# EAGLE design controller (EAGLE 5.11)
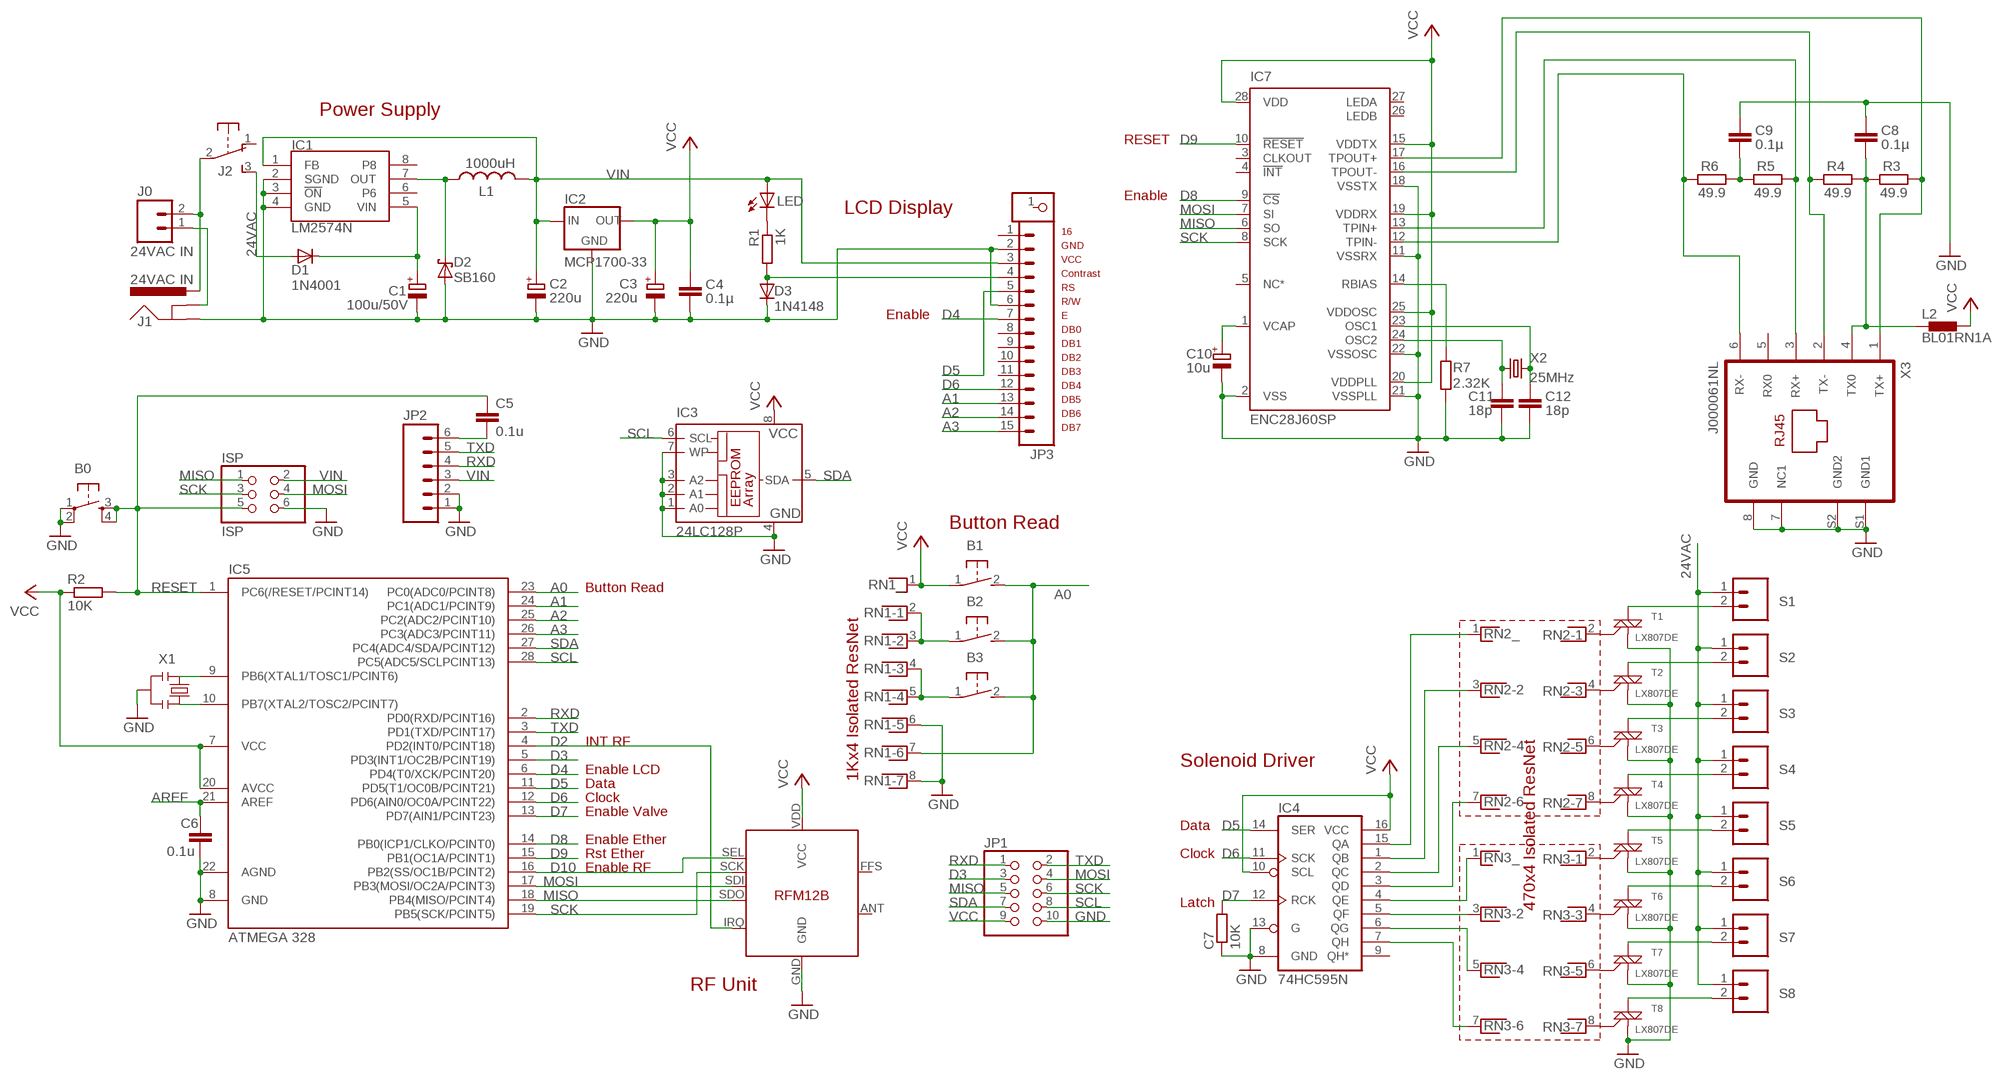
[diagram p0: schematic, sheet 1]

## Parts
B0  TAC_SWITCHPTH  [TACTILE-PTH]
B1  31-XX  [B3F-31XX]
B2  31-XX  [B3F-31XX]
B3  31-XX  [B3F-31XX]
C1  100u/50V  CPOL-EUE3.5-8  [E3,5-8]
C2  220u  CPOL-EUE2-5  [E2-5]
C3  220u  CPOL-EUE2-5  [E2-5]
C4  0.1µ  C-EU025-024X044  [C025-024X044]
C5  0.1u  C-EU025-024X044  [C025-024X044]
C6  0.1u  C-EU025-024X044  [C025-024X044]
C7  10K  R-EU_0204/7  [0204/7]
C8  0.1µ  C-EU025-024X044  [C025-024X044]
C9  0.1µ  C-EU025-024X044  [C025-024X044]
C10  10u  CPOL-EUE1.8-4  [E1,8-4]
C11  18p  C-EU025-024X044  [C025-024X044]
C12  18p  C-EU025-024X044  [C025-024X044]
D1  1N4001  DIODE-DO41-7.6  [DO41-7.6]
D2  SB160  1N5817-B  [DO41-7.6]
D3  1N4148  1N4148DO35-7  [DO35-7]
IC1  LM2574N  [DIL08]
IC2  MCP1700-33  MCP1700INLINE  [TO92-INLINE]
IC3  24LC128P  [DIL8]
IC4  74HC595N  74LS595N  [DIL16]
IC5  ATMEGA 328  ATMEGA48/88/168-PU  [DIL28-3]
IC6  RFM12B  [RFM12B]
IC7  ENC28J60SP  [DIL28-3]
ISP  ISP  PINHD-2X3  [2X03]
J0  24VAC IN  M025MM  [SCREWTERMINAL-5MM-2]
J1  24VAC IN  POWER_JACKPTH_LOCK  [POWER_JACK_PTH_LOCK]
J2  EG1206  [EG1206]
JP1  PINHD-2X5  [2X05]
JP2  M06SIP  [1X06]
JP3  M15  [1X15]
JP4  D  PINHD-1X1  [1X01]
L1  1000uH  L-US6000-XXX-RC  [6000-XXXX-RC]
L2  BL01RN1A  [BL01RN1A]
LED  POWERLED  LED3MM  [LED3MM]
R1  1K  R-EU_0204/7  [0204/7]
R2  10K  R-EU_0204/7  [0204/7]
R3  49.9  R-EU_0204/7  [0204/7]
R4  49.9  R-EU_0204/7  [0204/7]
R5  49.9  R-EU_0204/7  [0204/7]
R6  49.9  R-EU_0204/7  [0204/7]
R7  2.32K  R-EU_0204/7  [0204/7]
RN1  RNX7  [RN-8]
RN2  RNX7  [RN-8]
RN3  RNX7  [RN-8]
S1  M025MM  [SCREWTERMINAL-5MM-2]
S2  M025MM  [SCREWTERMINAL-5MM-2]
S3  M025MM  [SCREWTERMINAL-5MM-2]
S4  M025MM  [SCREWTERMINAL-5MM-2]
S5  M025MM  [SCREWTERMINAL-5MM-2]
S6  M025MM  [SCREWTERMINAL-5MM-2]
S7  M025MM  [SCREWTERMINAL-5MM-2]
S8  M025MM  [SCREWTERMINAL-5MM-2]
T1  LX807DE  [TO-92]
T2  LX807DE  [TO-92]
T3  LX807DE  [TO-92]
T4  LX807DE  [TO-92]
T5  LX807DE  [TO-92]
T6  LX807DE  [TO-92]
T7  LX807DE  [TO-92]
T8  LX807DE  [TO-92]
X1  RESONATORPTH  [RESONATOR-PTH]
X2  25MHz  CRYSTALHC49US  [HC49US]
X3  J000061NL  [PJ-J0-NOLED]

## Nets
24VAC [power]: D1.A J2.3(S) S1.1 S2.1 S3.1 S4.1 S5.1 S6.1 S7.1 S8.1
24VACIN [power]: J0.2 J1.PWR J2.2(P)
A0: B1.2(S) B2.2(S) B3.2(S) IC5.23(PC0(ADC0/PCINT8)) RN1.7
A1: IC5.24(PC1(ADC1/PCINT9)) JP3.13
A2: IC5.25(PC2(ADC2/PCINT10)) JP3.14
A3: IC5.26(PC3(ADC3/PCINT11)) JP3.15
AREF: C6.1 IC5.21(AREF)
D2: IC5.4(PD2(INT0/PCINT18)) IC6.IRQ
D3: IC5.5(PD3(INT1/OC2B/PCINT19)) JP1.3
D4: IC5.6(PD4(T0/XCK/PCINT20)) JP3.7
D5: IC4.14(SER) IC5.11(PD5(T1/OC0B/PCINT21)) JP3.5
D6: IC4.11(SCK) IC5.12(PD6(AIN0/OC0A/PCINT22)) JP3.12
D7: C7.2 IC4.12(RCK) IC5.13(PD7(AIN1/PCINT23))
D8: IC5.14(PB0(ICP1/CLKO/PCINT0)) IC7.9(!CS)
D9: IC5.15(PB1(OC1A/PCINT1)) IC7.10(!RESET)
D10: IC5.16(PB2(SS/OC1B/PCINT2)) IC6.SEL
GND [power]: B0.1 B0.2 C1.- C2.- C3.- C4.2 C6.2 C7.1 C8.1 C9.1 C10.- C11.2 C12.2 D2.A D3.C IC1.2(SGND) IC1.3(!ON) IC1.4(GND) IC2.1(GND) IC3.1(A0) IC3.2(A1) IC3.3(A2) IC3.4(GND) IC3.7(WP) IC4.8(GND) IC4.13(G) IC5.8(GND) IC5.22(AGND) IC6.GND IC7.2(VSS) IC7.11(VSSRX) IC7.18(VSSTX) IC7.21(VSSPLL) IC7.22(VSSOSC) ISP.6 J1.GND JP1.10 JP2.1 JP2.2 JP3.2 JP3.6 R7.2 RN1.6 RN1.8 T1.1(M1) T2.1(M1) T3.1(M1) T4.1(M1) T5.1(M1) T6.1(M1) T7.1(M1) T8.1(M1) X1.2 X3.7(NC1) X3.8(GND) X3.S1(GND1) X3.S2(GND2)
MISO: IC5.18(PB4(MISO/PCINT4)) IC6.SDO IC7.6(SO) ISP.1 JP1.5
MOSI: IC5.17(PB3(MOSI/OC2A/PCINT3)) IC6.SDI IC7.7(SI) ISP.4 JP1.4
N$2: IC5.9(PB6(XTAL1/TOSC1/PCINT6)) X1.1
N$3: RN2.2 T1.2(G)
N$4: IC4.5(QF) RN3.3
N$5: IC4.6(QG) RN3.5
N$6: C5.2 JP2.6
N$7: IC4.7(QH) RN3.7
N$8: IC5.10(PB7(XTAL2/TOSC2/PCINT7)) X1.3
N$9 [power]: C1.+ D1.C IC1.5(VIN)
N$10: IC4.4(QE) RN3.1
N$11: IC4.3(QD) RN2.7
N$12: IC4.2(QC) RN2.5
N$13: IC4.1(QB) RN2.3
N$14: IC4.15(QA) RN2.1
N$15: RN2.4 T2.2(G)
N$16 [power]: S1.2 T1.3(M2)
N$17 [power]: S2.2 T2.3(M2)
N$18 [power]: S3.2 T3.3(M2)
N$19: RN2.6 T3.2(G)
N$20 [power]: S4.2 T4.3(M2)
N$21: RN2.8 T4.2(G)
N$22 [power]: S5.2 T5.3(M2)
N$23 [power]: S6.2 T6.3(M2)
N$24 [power]: S7.2 T7.3(M2)
N$25 [power]: S8.2 T8.3(M2)
N$26: RN3.2 T5.2(G)
N$27: RN3.4 T6.2(G)
N$28: RN3.6 T7.2(G)
N$29: RN3.8 T8.2(G)
N$30: C8.2 L2.1 R3.1 R4.2 X3.4(TX0)
N$31: LED.K(C) R1.1
N$32: B2.1(P) RN1.2 RN1.3
N$35: B3.1(P) RN1.4 RN1.5
N$39: D3.A JP3.4 R1.2
N$40 [power]: D2.C IC1.7(OUT) L1.1
N$41: IC7.17(TPOUT+) R3.2 X3.1(TX+)
N$42: IC7.16(TPOUT-) R4.1 X3.2(TX-)
N$43: IC7.13(TPIN+) R5.2 X3.3(RX+)
N$44: IC7.12(TPIN-) R6.1 X3.6(RX-)
N$45 [power]: J0.1 J1.GNDBREAK
N$50: C10.+ IC7.1(VCAP)
N$51: IC7.14(RBIAS) R7.1
N$52: C11.1 IC7.24(OSC2) X2.1
N$53: C12.1 IC7.23(OSC1) X2.2
N$54: C9.2 R5.1 R6.2
RESET: B0.3 B0.4 C5.1 IC5.1(PC6(/RESET/PCINT14)) ISP.5 R2.2
RXD: IC5.2(PD0(RXD/PCINT16)) JP1.1 JP2.4
SCK: IC5.19(PB5(SCK/PCINT5)) IC6.SCK IC7.8(SCK) ISP.3 JP1.6
SCL: IC3.6(SCL) IC5.28(PC5(ADC5/SCLPCINT13)) JP1.8
SDA: IC3.5(SDA) IC5.27(PC4(ADC4/SDA/PCINT12)) JP1.7
TXD: IC5.3(PD1(TXD/PCINT17)) JP1.2 JP2.5
VCC: B1.1(P) C3.+ C4.1 IC2.3(OUT) IC3.8(VCC) IC4.10(SCL) IC4.16(VCC) IC5.7(VCC) IC5.20(AVCC) IC6.VDD(VCC) IC7.15(VDDTX) IC7.19(VDDRX) IC7.20(VDDPLL) IC7.25(VDDOSC) IC7.28(VDD) JP1.9 L2.2 R2.1 RN1.1
VIN: C2.+ IC1.1(FB) IC2.2(IN) ISP.2 JP2.3 JP3.3 L1.2 LED.A
Unconnected: IC1.6 IC1.8 IC4.9(QH*) IC6.ANT IC6.FFS IC7.3(CLKOUT) IC7.4(!INT) IC7.5(NC*) IC7.26(LEDB) IC7.27(LEDA) J2.1(O) JP3.1 JP3.8 JP3.9 JP3.10 JP3.11 JP4.1 X3.5(RX0)

## Notes on the sheet
- Power Supply
- RESET
- Enable
- LCD Display
- 16
- GND
- VCC
- Contrast
- RS
- R/W
- Enable | E
- DB0
- DB1
- DB2
- DB3
- DB4
- DB5
- DB6
- DB7
- Button Read
- Button Read
- 470x4 Isolated ResNet
- INT RF
- Solenoid Driver
- Enable LCD
- 1Kx4 Isolated ResNet
- Data
- Clock
- Enable Valve
- Data
- Enable Ether
- Rst Ether | Clock
- Enable RF
- Latch
- RF Unit

## Library data of the parts
B0 = SparkFun:TAC_SWITCH: Momentary Switch Button commonly used for reset or general input. Spark Fun Electronics SKU : COM-00097
B1-B3 = adafruit:31-XX: OMRON SWITCH Now with beefier pads!
C1-C3 C10 = resistor:CPOL-EU: POLARIZED CAPACITOR, European symbol
C4 C8 C9 C11 C12 = resistor:C-EU: CAPACITOR, European symbol
C5 C6 = rcl:C-EU: CAPACITOR, European symbol
C7 R1-R7 = rcl:R-EU_: RESISTOR, European symbol
D1 = diode:DIODE-: DIODE
D2 = diode:1N581*: 1.0A SCHOTTKY BARRIER RECTIFIER Source: http://www.diodes.com/datasheets/ds23001.pdf
D3 = diode:1N4148: DIODE high speed (Philips)
IC1 = linear-technology:LM2574N
IC2 = adafruit:MCP1700: VOLTAGE REGULATOR
IC3 = microchip:24*: Serial EEPROM I2C; MF: MICROCHIP; MPN: 24LC128-I/P; OC_FARNELL: 9757929; OC_NEWARK: 12C2007
IC4 = SparkFun:74*595: 8-bit SHIFT REGISTER, output latch
IC5 = atmega8:ATMEGA48/88/168-PU
IC6 = JeeLabs:RFM12B
IC7 = microchip:ENC28J60: Stand-Alone Ethernet Controller with SPI Interface Source: http://ww1.microchip.com/downloads/en/DeviceDoc/39662c.pdf; MF: MICROCHIP; MPN: ENC28J60/SP; OC_FARNELL: 1084619; OC_NEWARK: 96K3661
ISP = pinhead:PINHD-2X3: PIN HEADER
J0 S1-S8 = SparkFun:M02: Header 2 Standard 2-pin 0.1" header. Use with straight break away headers (SKU : PRT-00116), right angle break away headers (PRT-00553), swiss pins (PRT-00743), machine pins (PRT-00117), and female headers (PRT-00115). Molex polarized connector foot print use with SKU : PRT-08233 with associated crimp pins and housings.
J1 = SparkFun:POWER_JACK: Power Jack This is the standard 5.5mm barrel jack for power. The PTH is the most common, proven, reliable, footprint. All others are experimental. The Slot footprint only works if the mill layer is transmitted to the PCB fab house so be warned. Spark Fun Electronics SKU : PRT-00119. Mating wall wart : TOL-00298 (and others)
J2 = adafruit:EG1206
JP1 = pinhead:PINHD-2X5: PIN HEADER
JP2 = SparkFun:M06: Header 6 Standard 6-pin 0.1" header. Use with straight break away headers (SKU : PRT-00116), right angle break away headers (PRT-00553), swiss pins (PRT-00743), machine pins (PRT-00117), and female headers (PRT-00115). Molex polarized connector foot print use with SKU : PRT-08094 with associated crimp pins and housings. NOTES ON THE VARIANTS LOCK and LOCK_LONGPADS... This footprint was designed to help hold the alignment of a through-hole component (i.e. 6-pin header) while soldering it into place. You may notice that each hole has been shifted either up or down by 0.005 of an inch from it's more standard position (which is a perfectly straight line). This slight alteration caused the pins (the squares in the middle) to touch the edges of the holes. Because they are alternating, it causes a "brace" to hold the component in place. 0.005 has proven to be the perfect amount of "off-center" position when using our standard breakaway headers. Although looks a little odd when you look at the bare footprint, once you have a header in there, the alteration is very hard to notice. Also, if you push a header all the way into place, it is covered up entirely on the bottom side. This idea of altering the position of holes to aid alignment will be further integrated into the Sparkfun Library for other footprints. It can help hold any component with 3 or more connection pins.
JP3 = SparkFun:M15: Header 15 Standard 15-pin 0.1" header. Use with straight break away headers (SKU : PRT-00116), right angle break away headers (PRT-00553), swiss pins (PRT-00743), machine pins (PRT-00117), and female headers (PRT-00115).
JP4 = pinhead:PINHD-1X1: PIN HEADER
L1 = rcl:L-US: INDUCTOR, American symbol
L2 = inductors:BL0: Noise Suppression Products/EMI Suppression Filters, Lead EMIFIL(R) Inductor Type Source: http://www.murata.com .. BL01RN1_DS.pdf
LED = adafruit:LED: LED OSRAM: - CHIPLED LG R971, LG N971, LY N971, LG Q971, LY Q971, LO R971, LY R971 LH N974, LH R974 LS Q976, LO Q976, LY Q976 LO Q996 - Hyper CHIPLED LW Q18S LB Q993, LB Q99A, LB R99A - SideLED LS A670, LO A670, LY A670, LG A670, LP A670 LB A673, LV A673, LT A673, LW A673 LH A674 LY A675 LS A676, LA A676, LO A676, LY A676, LW A676 LS A679, LY A679, LG A679 - Hyper Micro SIDELED® LS Y876, LA Y876, LO Y876, LY Y876 LT Y87S - SmartLED LW L88C, LW L88S LB L89C, LB L89S, LG L890 LS L89K, LO L89K, LY L89K LS L896, LA L896, LO L896, LY L896 - TOPLED LS T670, LO T670, LY T670, LG T670, LP T670 LSG T670, LSP T670, LSY T670, LOP T670, LYG T670 LG T671, LOG T671, LSG T671 LB T673, LV T673, LT T673, LW T673 LH T674 LS T676, LA T676, LO T676, LY T676, LB T676, LH T676, LSB T676, LW T676 LB T67C, LV T67C, LT T67C, LS T67K, LO T67K, LY T67K, LW E67C LS E67B, LA E67B, LO E67B, LY E67B, LB E67C, LV E67C, LT E67C LW T67C LS T679, LY T679, LG T679 LS T770, LO T770, LY T770, LG T770, LP T770 LB T773, LV T773, LT T773, LW T773 LH T774 LS E675, LA E675, LY E675, LS T675 LS T776, LA T776, LO T776, LY T776, LB T776 LHGB T686 LT T68C, LB T68C - Hyper Mini TOPLED® LB M676 - Mini TOPLED Santana® LG M470 LS M47K, LO M47K, LY M47K Source: http://www.osram.convergy.de/
RN1-RN3 = resistor-net:RNX7: RESISTOR NETWORK; OC_FARNELL: unknown; OC_NEWARK: unknown
T1-T8 = SparkFun:LX807DE: LX807DE Triac http://www.littelfuse.com/data/en/Data_Sheets/Littelfuse_Triac_LX8.pdf
X1 = SparkFun:RESONATOR: Resonator Small SMD resonator. This is the itty bitty 10/20MHz resonators with built in caps. CSTCE10M0G55 and CSTCE20M0V53. Footprint has been reviewed closely but hasn't been tested yet.
X2 = SparkFun:CRYSTAL: Crystals Various standard crystals. Proven footprints. Spark Fun Electronics SKU : COM-00534
X3 = con-pulse:J000061NL

## Net classes
0 default: width 0.406 mm, clearance 0.203 mm
1 power: width 0.813 mm, clearance 0.203 mm

## Board
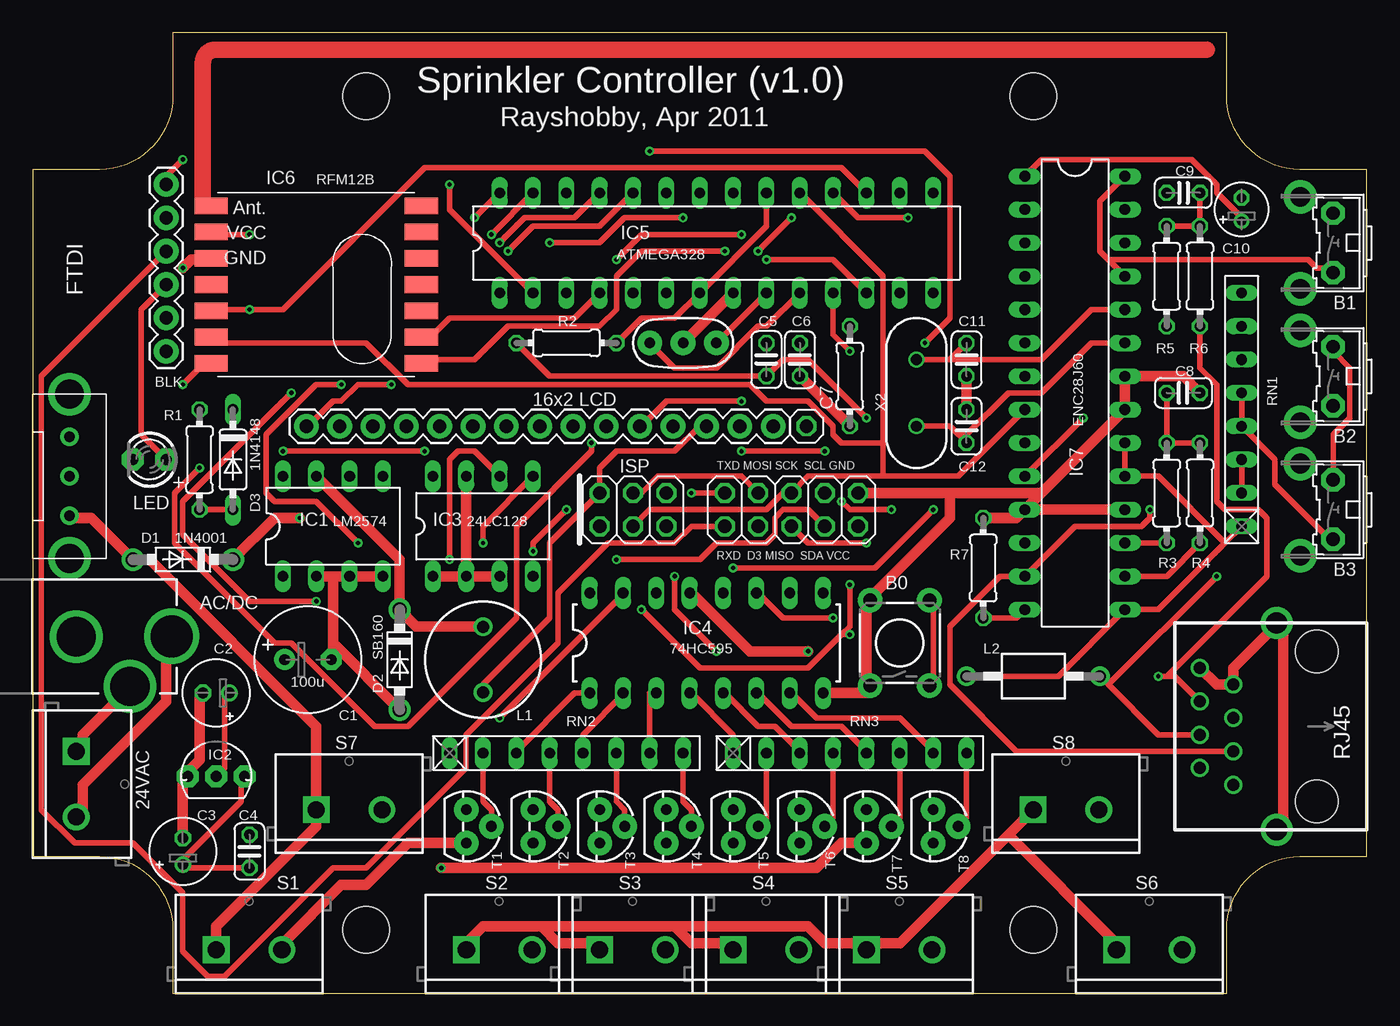
[diagram p1: board, top side]
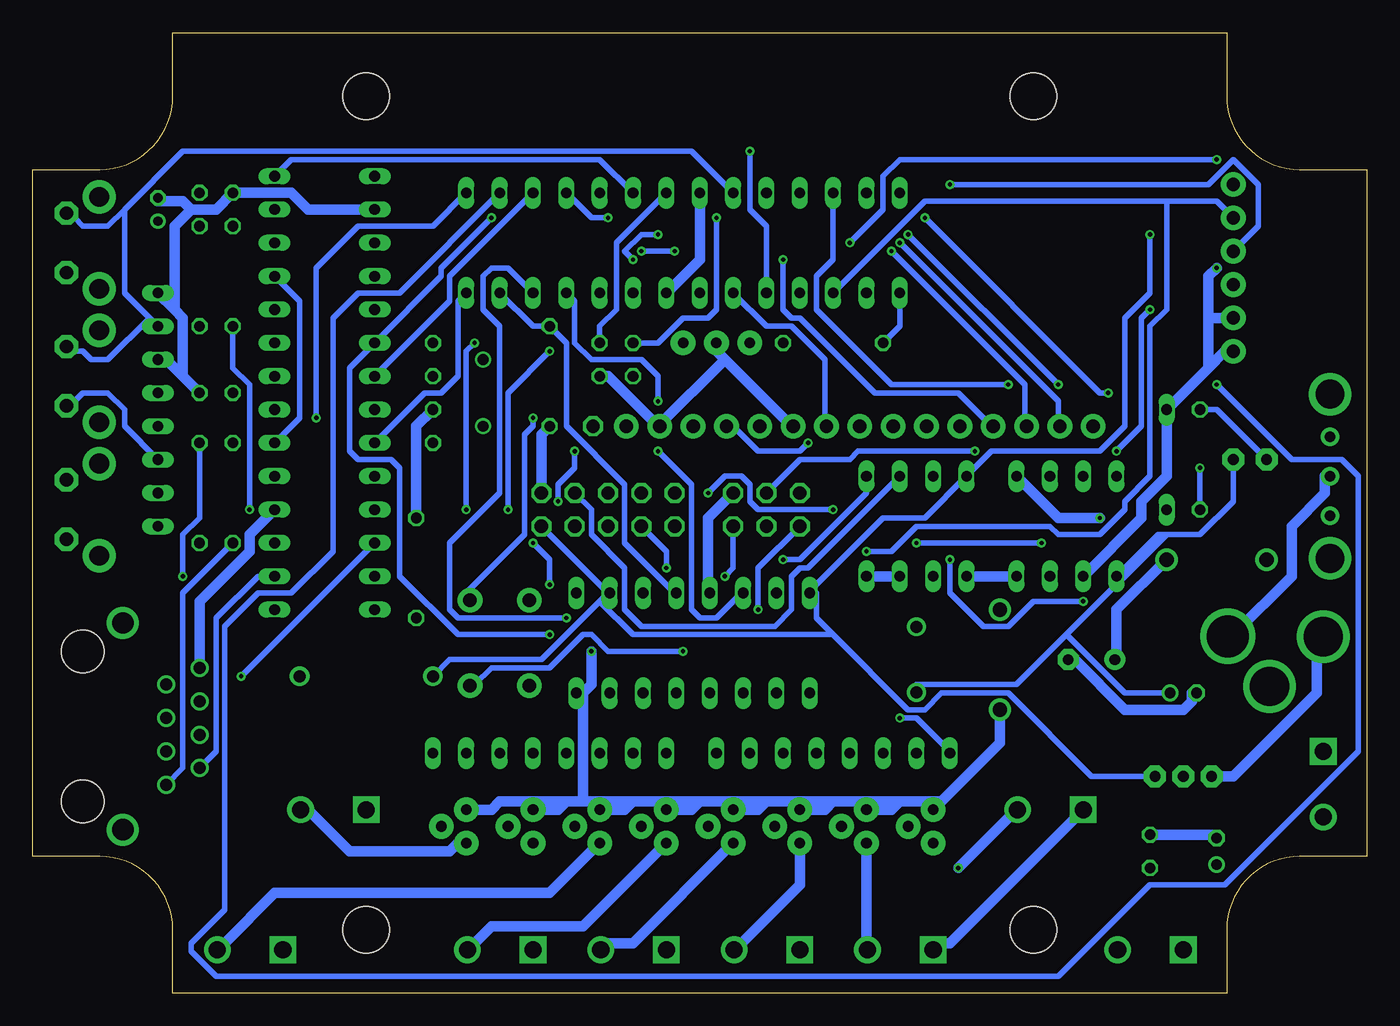
[diagram p2: board, bottom side, seen from below]

Size 101.6 x 73.15 mm. Coordinates in mm from the lower left corner, seen from the top.
Outline: 10.67,0 90.93,0 90.93,4.83 arc-90 96.52,10.41 101.6,10.41 101.6,62.74 96.52,62.74 arc-90 90.93,68.33 90.93,73.15 10.67,73.15 10.67,68.33 arc-90 5.08,62.74 0,62.74 0,10.41 5.08,10.41 arc-90 10.67,4.83 10.67,0
Copper layers (1*16): Top 0.0356mm / dielectric 1.5011mm / Bottom 0.0356mm
Design rules "LaenPCBOrder": minimum track width 6mil, minimum drill 13mil, track to track 6mil, track to pad 6mil, pad to pad 6mil, via to via 6mil, smd to smd 6mil, copper to edge 15mil, drill to drill 6mil, minimum pad ring 7mil, minimum via ring 7mil, stop-mask expansion 4mil, vias tented up to drill 0mil, thermal gap 10mil
Holes 3.56 mm at 25.4,4.83 76.2,4.83 25.4,68.33 76.2,68.33
tRestrict: area 22.9,2.3 to 27.9,7.4; area 73.7,2.3 to 78.7,7.4; area 10.9,65.3 to 90.7,72.6; area 7.6,36.8 to 10.2,38.1; area 44.5,39.4 to 47,40.6; area 99.1,17.8 to 100.3,22.9; area 36.8,44.5 to 44.5,45.7; area 52.1,39.9 to 63.5,40.6; area 52.1,33 to 63.5,33.8
bRestrict: area 10.9,65.3 to 90.7,72.6

### Footprints (pad centres in the part's own frame; a part is rotated, then mirrored left to right if it is on the bottom)
TACTILE-PTH = drill 1.016 pad 1.88 round: 1 -3.251,2.261; 2 3.251,2.261; 3 -3.251,-2.261; 4 3.251,-2.261
B3F-31XX = drill 1.016 pad 1.778 octagon: 1 -2.261,-1.245; 2 2.261,-1.245 | drill 1.499 pad 2.54 round: 3 -3.505,1.245; 4 3.505,1.245
E3,5-8 = drill 0.813 pad 1.6 round: + -1.778,0 | drill 0.813 pad 1.6 octagon: - 1.778,0
E2-5 = drill 0.813 pad 1.27 round: + -1.016,0 | drill 0.813 pad 1.27 octagon: - 1.016,0
C025-024X044 = drill 0.813 octagon: 1 -1.27,0; 2 1.27,0
0204/7 = drill 0.813 octagon: 1 -3.81,0; 2 3.81,0
E1,8-4 = drill 0.711 pad 1.168 round: + -0.889,0 | drill 0.711 pad 1.168 octagon: - 0.889,0
DO41-7.6 = drill 1.1 pad 1.7 round: A 3.81,0; C -3.81,0
DO35-7 = drill 0.813 long: A 3.81,0; C -3.81,0
DIL08 = drill 0.813 long: 1 -3.81,-3.81; 2 -1.27,-3.81; 3 1.27,-3.81; 4 3.81,-3.81; 5 3.81,3.81; 6 1.27,3.81; 7 -1.27,3.81; 8 -3.81,3.81
TO92-INLINE = drill 0.813 pad 1.676 octagon: 1 -2.159,0; 2 0,0; 3 2.159,0
DIL8 = drill 0.813 long: 1 -3.81,-3.81; 2 -1.27,-3.81; 3 1.27,-3.81; 4 3.81,-3.81; 5 3.81,3.81; 6 1.27,3.81; 7 -1.27,3.81; 8 -3.81,3.81
DIL16 = drill 0.813 long: 1 -8.89,-3.81; 2 -6.35,-3.81; 3 -3.81,-3.81; 4 -1.27,-3.81; 5 1.27,-3.81; 6 3.81,-3.81; 7 6.35,-3.81; 8 8.89,-3.81; 9 8.89,3.81; 10 6.35,3.81; 11 3.81,3.81; 12 1.27,3.81; 13 -1.27,3.81; 14 -3.81,3.81; 15 -6.35,3.81; 16 -8.89,3.81
DIL28-3 = drill 0.813 long: 1 -16.51,-3.81; 2 -13.97,-3.81; 3 -11.43,-3.81; 4 -8.89,-3.81; 5 -6.35,-3.81; 6 -3.81,-3.81; 7 -1.27,-3.81; 8 1.27,-3.81; 9 3.81,-3.81; 10 6.35,-3.81; 11 8.89,-3.81; 12 11.43,-3.81; 13 13.97,-3.81; 14 16.51,-3.81; 15 16.51,3.81; 16 13.97,3.81; 17 11.43,3.81; 18 8.89,3.81; 19 6.35,3.81; 20 3.81,3.81; 21 1.27,3.81; 22 -1.27,3.81; 23 -3.81,3.81; 24 -6.35,3.81; 25 -8.89,3.81; 26 -11.43,3.81; 27 -13.97,3.81; 28 -16.51,3.81
RFM12B = smd 2.54 x 1.27: ANT 8,-6; FFS -8,2; GND 8,-2; IRQ -8,4; P$8 -8,0; P$9 -8,-2; P$10 -8,-4; P$12 -8,-6; P$16 8,0; SCK 8,4; SDI 8,2; SDO -8,6; SEL 8,6; VDD 8,-4
2X03 = drill 1.016 octagon: 1 -2.54,-1.27; 2 -2.54,1.27; 3 0,-1.27; 4 0,1.27; 5 2.54,-1.27; 6 2.54,1.27
SCREWTERMINAL-5MM-2 = drill 1.3 pad 2.032 square: 1 0,0 | drill 1.3 pad 2.032 round: 2 5,0
POWER_JACK_PTH_LOCK = drill 2.997 round: GND 0.025,6.608; GNDBREAK 3.812,10.7 | drill 3.2 round: PWR 0,13.878
EG1206 = drill 0.8 pad 1.422 round: 1 -3,0; 2 0,0; 3 3,0 | drill 2.2 round: MT1 -6.25,0; MT2 6.25,0
2X05 = drill 1.016 octagon: 1 -5.08,-1.27; 2 -5.08,1.27; 3 -2.54,-1.27; 4 -2.54,1.27; 5 0,-1.27; 6 0,1.27; 7 2.54,-1.27; 8 2.54,1.27; 9 5.08,-1.27; 10 5.08,1.27
1X06 = drill 1.016 pad 1.88 round: 1 0,0; 2 2.54,0; 3 5.08,0; 4 7.62,0; 5 10.16,0; 6 12.7,0
1X15 = drill 1.016 pad 1.88 round: 1 0,0; 2 2.54,0; 3 5.08,0; 4 7.62,0; 5 10.16,0; 6 12.7,0; 7 15.24,0; 8 17.78,0; 9 20.32,0; 10 22.86,0; 11 25.4,0; 12 27.94,0; 13 30.48,0; 14 33.02,0; 15 35.56,0
1X01 = drill 1.016 octagon: 1 0,0
6000-XXXX-RC = drill 0.9 pad 1.422 round: 1 -2.5,0; 2 2.5,0
BL01RN1A = drill 0.9 pad 1.5 round: 1 -5.08,0; 2 5.08,0
LED3MM = drill 0.813 pad 1.676 octagon: A -1.27,0; K 1.27,0
RN-8 = drill 0.813 long: 1 -8.89,0; 2 -6.35,0; 3 -3.81,0; 4 -1.27,0; 5 1.27,0; 6 3.81,0; 7 6.35,0; 8 8.89,0
TO-92 = drill 0.813 pad 1.88 round: 1 -1.27,0; 2 0,1.905; 3 1.27,0
RESONATOR-PTH = drill 0.8 pad 1.88 round: 1 -2.54,0; 2 0,0; 3 2.54,0
HC49US = drill 0.813 round: 1 -2.54,0; 2 2.54,0
PJ-J0-NOLED = drill 0.914 round: 1 4.445,-6.35; 2 3.175,-8.89; 3 1.905,-6.35; 4 0.635,-8.89; 5 -0.635,-6.35; 6 -1.905,-8.89; 7 -3.175,-6.35; 8 -4.445,-8.89 | drill 1.626 round: S1 -7.874,-3.048; S2 7.874,-3.048 | hole 3.251: -5.715,0; 5.715,0

### Placement (x,y rotation side)
B0  66.04,26.67 90 top
B1  97.79,57.15 90 top
B2  97.79,46.99 90 top
B3  97.79,36.83 90 top
C1  20.95,25.4 0 top
C2  13.97,22.86 180 top
C3  11.43,10.79 90 top
C4  16.51,10.79 90 top
C5  55.88,48.26 90 top
C6  58.42,48.26 270 top
C7  62.23,46.99 90 top
C8  87.63,45.72 180 top
C9  87.63,60.96 0 top
C10  92.08,59.69 90 top
C11  71.12,48.26 270 top
C12  71.12,43.18 90 top
D1  11.43,33.02 180 top
D2  27.94,25.4 270 top
D3  15.24,40.64 270 top
IC1  22.86,35.56 0 top
IC2  13.97,16.51 0 top
IC3  34.29,35.56 0 top
IC4  51.31,26.67 0 top
IC5  52.07,57.15 0 top
IC6  21.59,53.98 180 top
IC7  79.38,45.72 270 top
ISP  45.72,36.83 0 top
J0  3.3,18.41 270 top
J1  -3.3,27.18 270 top
J2  2.79,39.37 270 top
JP1  57.78,36.83 0 top
JP2  10.16,48.9 90 top
JP3  56.39,43.18 180 top
JP4  58.93,43.18 0 top
L1  34.29,25.4 270 top
L2  76.2,24.13 180 top
LED  8.89,40.64 180 top
R1  12.7,40.64 270 top
R2  40.64,49.53 180 top
R3  86.36,38.1 270 top
R4  88.9,38.1 90 top
R5  86.36,54.61 270 top
R6  88.9,54.61 90 top
R7  72.39,32.38 90 top
RN1  92.08,44.45 90 top
RN2  40.64,18.29 0 top
RN3  62.23,18.29 0 top
S1  13.97,3.3 0 top
S2  33.02,3.3 0 top
S3  43.18,3.3 0 top
S4  53.34,3.3 0 top
S5  63.5,3.3 0 top
S6  82.55,3.3 0 top
S7  21.59,13.97 0 top
S8  76.2,13.97 0 top
T1  33.02,12.7 270 top
T2  38.1,12.7 270 top
T3  43.18,12.7 270 top
T4  48.26,12.7 270 top
T5  53.34,12.7 270 top
T6  58.42,12.7 270 top
T7  63.5,12.7 270 top
T8  68.58,12.7 270 top
X1  49.53,49.53 180 top
X2  67.31,45.72 270 top
X3  97.79,20.32 270 top

### Tracks (layer width: path | path; a pad name or v marks a point on that pad's centre or on a via)
24VAC
  Top 0.813: 63.5,3.81 66.04,3.81 74.3,12.06 | 74.3,12.06 S8.1 | 74.3,12.06 82.55,3.81 S6.1 | J2.3 3.17,36.2 4.45,36.2 D1.A 8.89,33.02 21.59,20.32 S7.1 21.59,12.7 13.97,5.08 S1.1 | 38.73,5.08 40.01,3.81 43.18,3.81 S3.1 | 38.73,5.08 34.29,5.08 33.02,3.81 S2.1 | 48.9,5.08 50.16,3.81 53.34,3.81 S4.1 | 38.73,5.08 48.9,5.08 | 63.5,3.81 60.33,3.81 59.05,5.08 48.9,5.08 | 63.5,3.81 S5.1
  Bottom 0.813: S7.1 31.75,3.81 33.02,3.81 S2.1
24VACIN
  Top 0.813: J0.2 3.81,13.97 3.81,15.88 10.16,22.23 10.16,26.67 J1.PWR
  Bottom 0.813: J2.2 3.17,39.37 3.17,38.1 5.71,35.56 5.71,31.75 10.16,27.3 J1.PWR
A0
  Top 0.406: B3.2 99.06,39.37 99.06,42.55 100.33,43.81 100.33,47.62 99.06,48.9 B2.2
  Bottom 0.406: IC5.23 51.44,64.14 90.17,64.14 94.61,59.69 | 94.61,59.69 95.89,58.42 97.79,58.42 98.42,59.05 B1.2 | 92.71,51.44 94.61,53.34 94.61,59.69 | 92.71,51.44 RN1.7 | 92.71,51.44 95.89,48.26 97.16,48.26 97.79,48.9 98.42,48.9 B2.2
A1  (via drill 0.33)
  Top 0.406: IC5.24 43.18,58.42 38.1,58.42 v36.2,56.52
  Bottom 0.406: v36.2,56.52 26.04,46.35 26.04,43.18 JP3.13
A2  (via drill 0.33)
  Top 0.406: IC5.25 41.27,59.05 37.47,59.05 v35.56,57.15
  Bottom 0.406: v35.56,57.15 23.5,45.09 23.5,43.18 JP3.14
A3  (via drill 0.33)
  Top 0.406: v27.3,46.35 24.77,46.35 23.5,45.09 22.86,45.09 20.95,43.18 JP3.15
  Bottom 0.406: IC5.26 40.64,55.88 41.91,54.61 41.91,52.07 36.2,46.35 v27.3,46.35
AREF
  Bottom 0.406: C6.1 58.42,50.8 57.15,52.07 57.15,57.15 IC5.21
D2
  Top 0.406: IC5.4 41.27,51.44 31.75,51.44 29.84,49.53 IC6.IRQ
D3  (via drill 0.33)
  Top 0.406: v46.99,64.14 67.94,64.14 69.85,62.23 69.85,51.44 v67.94,49.53 | v68.58,36.83 64.14,32.38 v53.34,32.38
  Bottom 0.406: IC5.5 45.72,58.42 46.99,59.69 v46.99,64.14 | v67.94,49.53 68.58,48.9 v68.58,36.83 | v53.34,32.38 53.34,33.66 JP1.3
D4
  Bottom 0.406: IC5.6 45.72,50.8 43.81,50.8 41.27,48.26 41.27,43.18 JP3.7
D5  (via drill 0.33)
  Top 0.406: v53.98,41.27 v60.33,41.27 | v61.59,37.47 62.23,36.83 v65.41,36.83 | v62.23,48.9 60.96,50.16 IC5.11 | v53.98,45.09 48.26,45.09 46.35,43.18 JP3.5
  Bottom 0.406: v53.98,41.27 51.44,38.73 51.44,29.21 50.8,28.57 49.53,28.57 47.62,30.48 IC4.14 | v60.33,41.27 60.33,40.01 61.59,38.73 v61.59,37.47 | v65.41,36.83 65.41,45.72 v62.23,48.9 | v53.98,45.09 53.98,46.99 55.24,48.26 59.05,48.26 60.33,49.53 60.33,52.7 IC5.11
D6  (via drill 0.33)
  Top 0.406: v60.96,28.57 57.15,28.57 55.24,30.48 IC4.11 | v44.45,55.88 46.35,57.78 v53.98,57.78 | v55.88,55.88 60.96,55.88 IC5.12
  Bottom 0.406: v60.96,28.57 69.22,28.57 69.85,29.21 69.85,34.29 66.04,38.1 66.04,50.8 67.31,52.07 67.31,54.61 66.67,55.24 65.41,55.24 IC5.12 | v44.45,55.88 44.45,52.07 43.81,51.44 43.18,51.44 37.47,45.72 31.11,45.72 28.57,43.18 JP3.12 | v53.98,57.78 55.24,57.78 56.52,56.52 v55.88,55.88
D7
  Bottom 0.406: IC4.12 52.7,30.48 56.52,34.29 56.52,38.73 60.96,43.18 60.96,49.53 C7.2 63.5,50.8 IC5.13
D8
  Bottom 0.406: IC7.9 71.75,45.72 70.48,45.72 69.22,46.99 69.22,52.7 IC5.14
D9  (via drill 0.33)
  Top 0.406: IC7.10 v80.01,43.81
  Bottom 0.406: v80.01,43.81 80.01,55.24 76.83,58.42 71.12,58.42 IC5.15
D10  (via drill 0.33)
  Top 0.406: v11.43,46.35 13.34,48.26 IC6.SEL
  Bottom 0.406: IC5.16 73.66,53.34 76.83,53.34 78.74,51.44 78.74,33.66 81.92,30.48 84.45,30.48 87,27.94 87,6.35 89.53,3.81 89.53,3.17 87.63,1.27 23.5,1.27 16.51,8.26 10.79,8.26 0.64,18.41 0.64,39.37 1.91,40.64 5.71,40.64 v11.43,46.35
GND  (via drill 0.33)
  Top 0.813: X1.2 IC5.8 | X3.8 90.17,23.5 X3.7 91.44,24.77 94.61,27.94 X3.S1 95.25,27.94 95.25,12.7 X3.S2 | C7.1 C6.2 | C12.2 C11.2 | R7.2 74.93,36.2 IC7.11 | IC7.11 IC7.18 | 76.83,38.1 IC7.11 | 76.83,38.1 IC7.21 IC7.22 87.63,46.99 C8.1 | 69.85,38.1 76.83,38.1 | 69.85,38.1 JP1.10 | 11.43,16.51 12.7,17.78 12.7,22.86 C2.- | C3.- 11.43,16.51 | 11.43,16.51 IC2.1 | IC4.8 63.5,22.86 B0.1 63.5,23.5 63.5,29.84 B0.2 64.14,30.48 69.85,36.2 69.85,38.1 | v59.05,26.04 54.61,26.04 50.16,30.48 IC4.13 | v11.43,55.24 12.06,55.88 13.34,55.88 IC6.GND | IC3.1 IC3.2 | IC3.2 IC3.3 | IC3.2 IC3.7 | 22.86,31.75 IC1.3 IC1.4 | 22.86,31.75 IC1.2 | 22.86,26.67 22.86,31.75 | 22.86,26.67 22.86,25.4 C1.- | 22.86,26.67 D2.A
  Bottom 0.813: IC5.22 50.8,55.88 IC5.8 | 48.9,48.26 49.53,48.9 X1.2 | 48.9,48.26 43.81,43.18 JP3.6 | JP1.10 62.87,42.55 C7.1 | 53.98,43.18 57.78,46.99 C6.2 | 89.53,59.69 90.17,60.33 92.08,60.33 C10.- | 89.53,59.69 87.63,59.69 C9.1 81.92,60.96 80.64,59.69 IC7.2 | 90.17,46.99 91.44,48.26 RN1.6 | C8.1 90.17,46.99 | 90.81,52.07 90.17,51.44 90.17,46.99 | 90.81,52.07 RN1.8 | C12.2 72.39,43.18 R7.2 | 89.53,59.69 90.81,58.42 90.81,52.07 | X3.8 88.9,29.84 85.09,33.66 85.09,34.92 IC7.18 | 53.98,43.18 48.9,48.26 | 53.98,43.18 JP3.2 | C4.2 11.43,12.06 C3.- | IC2.1 10.16,16.51 3.81,22.86 3.81,26.67 J1.GND | ISP.6 50.16,36.2 50.16,30.48 IC4.13 | v59.05,26.04 59.05,23.5 59.69,22.86 | 12.06,47.62 10.79,48.9 JP2.1 | 12.06,47.62 D3.C 15.24,39.37 17.14,37.47 17.14,36.2 IC1.2 | v11.43,55.24 12.06,54.61 12.06,51.44 | 12.06,47.62 12.06,51.44 | 12.06,51.44 JP2.2 | IC3.3 IC3.4 | 32.38,14.61 27.94,19.05 D2.A | T2.1 36.2,13.97 35.56,14.61 | 32.38,14.61 35.56,14.61 | 32.38,14.61 T1.1 | T3.1 41.27,13.97 40.64,14.61 | 35.56,14.61 40.64,14.61 | T4.1 46.35,13.97 45.72,14.61 | 40.64,14.61 45.72,14.61 | T5.1 51.44,13.97 50.8,14.61 | 45.72,14.61 50.8,14.61 | T6.1 56.52,13.97 55.88,14.61 | 50.8,14.61 55.88,14.61 | T7.1 61.59,13.97 60.96,14.61 | 55.88,14.61 59.69,14.61 | 59.69,14.61 60.96,14.61 | T8.1 66.67,13.97 66.04,14.61 60.96,14.61 | IC1.4 IC3.1 | 59.69,14.61 59.69,22.86 | 59.69,22.86 IC4.8 | C2.- 13.34,22.86 13.34,22.23 13.97,21.59 18.41,21.59 22.23,25.4 C1.-
MISO  (via drill 0.33)
  Top 0.406: v46.35,29.21 50.8,24.77 59.05,24.77 61.59,27.3 | 61.59,27.3 62.23,27.94 v62.23,31.11 | v63.5,34.29 59.05,34.29 JP1.5 | v66.67,59.05 62.87,59.05 IC5.18 | v52.7,56.52 46.35,56.52 44.45,54.61 44.45,52.07 43.18,50.8 36.2,50.8 33.66,48.26 29.84,48.26 IC6.SDO | v55.24,56.52 v57.78,59.05 | v62.23,27.3 61.59,27.3
  Bottom 0.406: ISP.1 46.35,32.38 v46.35,29.21 | v62.23,31.11 62.23,33.02 v63.5,34.29 | v66.67,59.05 70.48,55.24 70.48,54.61 IC7.6 77.47,47.62 77.47,41.27 76.83,40.64 74.3,40.64 73.66,40.01 73.66,31.75 69.22,27.3 v62.23,27.3 | v52.7,56.52 v55.24,56.52 | v57.78,59.05 59.05,59.05 IC5.18
MOSI  (via drill 0.33)
  Top 0.406: ISP.4 46.35,38.1 47.62,39.37 53.98,39.37 JP1.4 | IC5.17 61.59,62.87 29.84,62.87 19.05,52.07 v16.51,52.07 13.97,52.07 IC6.SDI | v19.05,41.27 v29.84,41.27
  Bottom 0.406: IC7.7 69.85,52.7 69.85,54.61 IC5.17 | ISP.4 43.18,40.64 39.37,40.64 38.73,41.27 v29.84,41.27 | v19.05,41.27 17.14,43.18 17.14,51.44 v16.51,52.07
N$1
  Top 1.27: 12.95,60.2 12.95,70.87 arc-90 13.97,71.88 89.41,71.88
N$2
  Top 0.406: X1.1 IC5.9
N$3
  Top 0.406: T1.2 34.92,13.97 34.29,14.61 RN2.2
N$4
  Top 0.406: IC4.5 52.7,22.86 55.24,20.32 56.52,20.32 58.42,18.41 RN3.3
N$5
  Top 0.406: IC4.6 55.24,22.86 57.78,20.32 61.59,20.32 63.5,18.41 RN3.5
N$6  (via drill 0.33)
  Top 0.406: v49.53,59.05 45.09,59.05 43.18,57.15 v39.37,57.15 | v11.43,63.5 10.16,62.23 JP2.6
  Bottom 0.406: C5.2 53.98,49.53 52.07,51.44 50.16,51.44 49.53,52.07 v49.53,59.05 | v39.37,57.15 36.83,59.69 36.83,62.23 35.56,63.5 v11.43,63.5
N$7
  Top 0.406: IC4.7 57.78,22.86 59.69,20.95 66.04,20.95 68.58,18.41 RN3.7
N$8
  Top 0.406: IC5.10 55.88,50.8 55.24,50.8 52.07,47.62 48.9,47.62 X1.3
N$9  (via drill 0.33)
  Top 0.813: v20.32,36.2 18.41,36.2 D1.C
  Bottom 0.813: IC1.5 23.5,36.2 v20.32,36.2 | D1.C 19.05,29.21 19.05,25.4 C1.+
N$10
  Top 0.406: RN3.1 53.34,19.68 50.16,22.86 IC4.4
N$11
  Top 0.406: RN2.7 46.99,22.86 IC4.3
N$12
  Top 0.406: RN2.5 41.91,19.68 45.09,22.86 IC4.2
N$13
  Top 0.406: RN2.3 36.83,18.41 41.27,22.86 IC4.1
N$14  (via drill 0.33)
  Top 0.406: v35.56,20.95 45.09,30.48 IC4.15
  Bottom 0.406: v35.56,20.95 34.29,20.95 31.75,18.41 RN2.1
N$15
  Top 0.406: T2.2 40.01,13.97 39.37,14.61 RN2.4
N$16
  Top 0.813: T1.3 28.57,11.43 25.4,8.26 23.5,8.26 19.05,3.81 S1.2
N$17
  Bottom 0.813: T2.3 38.1,3.81 S2.2
N$18
  Bottom 0.813: T3.3 43.18,8.26 47.62,3.81 S3.2
N$19
  Top 0.406: T3.2 45.09,13.97 44.45,14.61 RN2.6
N$20
  Bottom 0.813: T4.3 55.88,3.81 57.78,3.81 S4.2
N$21
  Top 0.406: T4.2 50.16,13.97 49.53,14.61 RN2.8
N$22
  Bottom 0.813: T5.3 59.69,5.08 66.67,5.08 67.94,3.81 S5.2
N$23
  Bottom 0.813: T6.3 62.23,7.62 83.19,7.62 87,3.81 S6.2
N$24  (via drill 0.33)
  Top 0.813: T7.3 61.59,11.43 59.69,9.53 v31.11,9.53
  Bottom 0.813: v31.11,9.53 26.67,13.97 S7.2
N$25
  Bottom 0.813: T8.3 69.22,11.43 69.85,10.79 77.47,10.79 80.64,13.97 S8.2
N$26
  Top 0.406: T5.2 55.88,13.34 RN3.2
N$27
  Top 0.406: T6.2 60.96,13.34 RN3.4
N$28
  Top 0.406: T7.2 66.04,13.34 RN3.6
N$29
  Top 0.406: T8.2 71.12,13.34 RN3.8
N$30  (via drill 0.33)
  Top 0.406: R4.2 R3.1 C8.2 | X3.4 85.72,19.68 81.92,23.5 | 81.92,23.5 L2.1 | 81.92,23.5 v90.17,31.75
  Bottom 0.406: R4.2 88.9,36.2 90.17,34.92 v90.17,31.75
N$31
  Bottom 0.406: R1.1 11.43,44.45 LED.K
N$32
  Top 0.406: RN1.2 RN1.3
  Bottom 0.406: RN1.3 94.61,43.18 94.61,44.45 95.89,45.72 97.79,45.72 98.42,45.09 B2.1
N$35
  Top 0.406: RN1.5 RN1.4 94.61,40.64 94.61,38.73 98.42,34.92 B3.1
N$39  (via drill 0.33)
  Top 0.406: R1.2 D3.A | v12.7,40.01 10.79,38.1 10.79,34.29 18.41,26.67 19.68,26.67 26.04,20.32 28.57,20.32 36.83,28.57 36.83,35.56 42.55,41.27 v42.55,41.91
  Bottom 0.406: v12.7,40.01 R1.2 | v42.55,41.91 43.18,41.27 46.35,41.27 48.26,43.18 JP3.4
N$40
  Top 0.813: IC1.7 27.94,33.02 D2.C 29.21,27.94 34.29,27.94 L1.1
N$41
  Top 0.406: R3.2 IC7.17
  Bottom 0.406: X3.1 90.17,17.14 90.17,30.48 R3.2
N$42
  Top 0.406: IC7.16 86.36,31.75 R4.1
  Bottom 0.406: X3.2 87.63,18.41 87.63,28.57 84.45,31.75 IC7.16
N$43  (via drill 0.33)
  Top 0.406: X3.3 74.93,18.41 69.85,23.5 69.85,27.94 73.66,31.75 IC7.13 79.38,35.56 84.45,35.56 85.09,36.2 v85.09,36.83
  Bottom 0.406: R5.2 86.36,47.62 85.09,46.35 v85.09,36.83
N$44  (via drill 0.33)
  Top 0.406: 86.36,24.13 87,24.13 X3.6 | v85.72,24.13 86.36,24.13 | R6.1 88.9,47.62 90.17,46.35 90.17,37.47 90.81,36.83 93.34,36.83 93.98,36.2 93.98,31.75 86.36,24.13
  Bottom 0.406: IC7.12 v85.72,24.13
N$45
  Top 0.813: J0.1 3.81,18.41 3.81,19.68 6.99,22.86 J1.GNDBREAK
N$50
  Top 0.406: IC7.1 76.83,63.5 88.27,63.5 90.17,61.59 90.17,60.96 92.08,59.05 C10.+
N$51
  Top 0.406: R7.1 74.93,28.57 IC7.14
N$52
  Top 0.406: X2.1 69.85,48.26 | 69.85,48.26 C11.1 | IC7.24 80.64,52.07 76.83,48.26 69.85,48.26
N$53
  Top 0.406: X2.2 69.85,43.18 70.48,42.55 | 70.48,42.55 C12.1 | IC7.23 80.64,49.53 76.83,45.72 74.3,45.72 71.12,42.55 70.48,42.55
N$54
  Top 0.406: R5.1 R6.2 C9.2
RESET  (via drill 0.33)
  Top 0.406: R2.2 39.37,46.99 C5.1 57.15,48.26 59.05,48.26 v63.5,43.81 | v48.9,31.75 48.9,29.21 v52.07,26.04 | B0.4 68.58,29.84 68.58,23.5 B0.3
  Bottom 0.406: IC5.1 35.56,50.8 R2.2 | ISP.5 48.26,32.38 v48.9,31.75 | v52.07,26.04 57.78,26.04 59.05,27.3 59.69,27.3 62.23,24.77 66.67,24.77 67.94,23.5 B0.3 | v63.5,43.81 63.5,43.18 64.14,42.55 64.14,34.92 68.58,30.48 B0.4
RXD  (via drill 0.33)
  Top 0.406: IC5.2 31.75,59.69 v31.75,61.59 | JP1.1 50.16,35.56 48.9,34.29 43.81,34.29 40.01,30.48 40.01,26.67 33.02,19.68 33.02,17.14 25.4,9.53 22.86,9.53 14.61,1.27 13.34,1.27 11.43,3.17 11.43,7.62 7.62,11.43 3.17,11.43 0.64,13.97 0.64,46.99 JP2.4
  Bottom 0.406: v31.75,61.59 12.06,61.59 10.16,63.5 8.26,61.59 8.26,58.42 JP2.4
SCK
  Top 0.406: IC7.8 70.48,39.37 64.77,39.37 | 64.77,39.37 59.05,39.37 JP1.6 57.15,38.1 55.88,36.83 46.99,36.83 ISP.3 | IC5.19 64.77,54.61 64.77,41.91 | 64.77,41.91 64.77,39.37 | 64.77,41.91 61.59,41.91 60.96,42.55 60.96,43.18 59.05,45.09 55.88,45.09 54.61,46.35 28.57,46.35 25.4,49.53 13.97,49.53 IC6.SCK
SCL  (via drill 0.33)
  Top 0.406: v33.66,59.05 IC5.28 | v19.68,45.72 11.43,37.47 11.43,34.92 16.51,29.84 v21.59,29.84 | v31.75,33.02 31.75,40.64 32.38,41.27 33.66,41.27 IC3.6
  Bottom 0.406: IC3.6 42.55,32.38 43.18,32.38 43.81,31.75 43.81,29.21 45.09,27.94 55.24,27.94 56.52,29.21 56.52,32.38 59.05,34.92 59.05,36.83 JP1.8 | v33.66,59.05 20.32,45.72 v19.68,45.72 | v21.59,29.84 25.4,29.84 27.3,27.94 29.21,27.94 31.75,30.48 v31.75,33.02
SDA  (via drill 0.33)
  Top 0.406: v44.45,33.02 50.8,33.02 52.07,34.29 55.88,34.29 56.52,34.92 56.52,36.2 57.15,36.83 59.05,36.83 JP1.7 | v34.92,57.78 IC5.27 | v23.5,46.35 21.59,46.35 17.78,42.55 17.78,38.1 18.41,37.47 21.59,37.47 v24.77,34.29 | v34.29,34.29 34.29,35.56 IC3.5
  Bottom 0.406: IC3.5 38.1,38.1 43.18,33.02 v44.45,33.02 | v23.5,46.35 v34.92,57.78 | v24.77,34.29 v34.29,34.29
TXD  (via drill 0.33)
  Top 0.406: v50.16,38.1 JP1.2 | v40.64,36.83 38.1,34.29 v38.1,33.66
  Bottom 0.406: IC5.3 33.66,60.33 15.24,60.33 | 15.24,60.33 11.43,60.33 JP2.5 | v50.16,38.1 48.9,39.37 47.62,39.37 46.99,38.73 46.99,37.47 46.35,36.83 v40.64,36.83 | v38.1,33.66 36.2,33.66 34.29,35.56 24.13,35.56 23.5,34.92 20.32,34.92 18.41,36.83 18.41,37.47 16.51,39.37 16.51,50.8 15.24,52.07 15.24,60.33
VCC  (via drill 0.33)
  Top 0.406: R2.1 46.35,51.44 48.9,51.44 IC5.7 55.88,58.42 IC5.20 | 81.92,55.88 81.28,56.52 81.28,60.33 IC7.28 | IC7.25 81.92,55.88 | 81.92,55.88 97.16,55.88 97.79,55.24 98.42,55.24 B1.1 | IC7.20 IC7.19 85.72,39.37 90.81,34.29 | 90.81,34.29 RN1.1 | 90.81,34.29 85.72,29.21 IC7.15 78.11,24.13 L2.2 | C4.1 11.43,9.53 C3.+ 11.43,10.16 15.88,14.61 15.88,16.51 IC2.3 | v16.51,57.78 13.97,57.78 IC6.VDD
  Bottom 0.406: IC5.20 58.42,63.5 81.92,63.5 IC7.28 | 57.78,30.48 JP1.9 | 58.42,29.84 62.87,25.4 69.85,25.4 L2.2 | 58.42,29.84 57.78,30.48 | 57.78,30.48 IC4.10 | v16.51,57.78 16.51,53.34 18.41,51.44 18.41,43.18 20.32,41.27 28.57,41.27 IC3.8 33.66,36.2 36.83,36.2 42.55,30.48 IC4.16 41.91,30.48 41.91,28.57 40.64,27.3 | 40.64,27.3 34.92,21.59 33.66,21.59 32.38,22.86 27.3,22.86 20.95,16.51 IC2.3 | 58.42,29.84 55.88,27.3 40.64,27.3 | IC7.25 81.28,52.7 81.28,43.81 IC7.20
VIN
  Top 0.406: JP3.3 50.8,43.18 48.9,41.27 44.45,41.27 43.18,40.01 ISP.2 39.37,34.29 39.37,28.57 34.29,23.5 L1.2 | IC2.2 14.61,17.14 14.61,22.86 C2.+ | JP2.3 8.26,52.07 8.26,42.55 LED.A
  Bottom 0.406: IC1.1 15.88,34.92 15.24,34.92 | 15.24,34.92 12.7,34.92 10.16,37.47 LED.A | 22.86,27.3 15.24,34.92 | 22.86,27.3 26.67,23.5 34.29,23.5 L1.2 | 22.86,27.3 18.41,22.86 C2.+

### Text on the board
tNames: Sprinkler Controller (v1.0) | Rayshobby, Apr 2011 | RFM12B | FTDI | ATMEGA328 | BLK | 16x2 LCD | 1N4148 | ENC28J60 | TXD MOSI SCK SCL GND | LM2574 | 24LC128 | 1N4001 | RXD D3 MISO SDA VCC | AC/DC | 74HC595 | SB160 | 100u | RJ45 | 24VAC
BoxDim: Serpac WM-032RC Enclosure | All units are in inch | Left | Right | Front | 0.14 | 0.32 | 1.28 | 0.91 | 0.32 | 1.0 | 0.26 | 0.4 | 0.29 | 3.25 | 0.45 | 0.7 | 0.53 | 0.4 | 0.32 | 0.63 | Bottom | 1.28 | 0.32 | 1.6 | 1.6 | 4.38